# Altium schematic sheet Sheet1.SchDoc
size A3; PageSetup: Record=PageOptions|CenterHorizontal=True|CenterVertical=True|PrintScale=0.73|XCorrection=1.00|YCorrection=1.00|PrintKind=0|BorderSize=5000000|LeftOffset=0|BottomOffset=0|Orientation=2|PaperLength=1000|PaperWidth=1000|Scale=100|PaperSource=7|PrintQuality=-3|MediaType=1|DitherType=10|PrintScaleMode=1|PaperKind=A4|PaperIndex=9
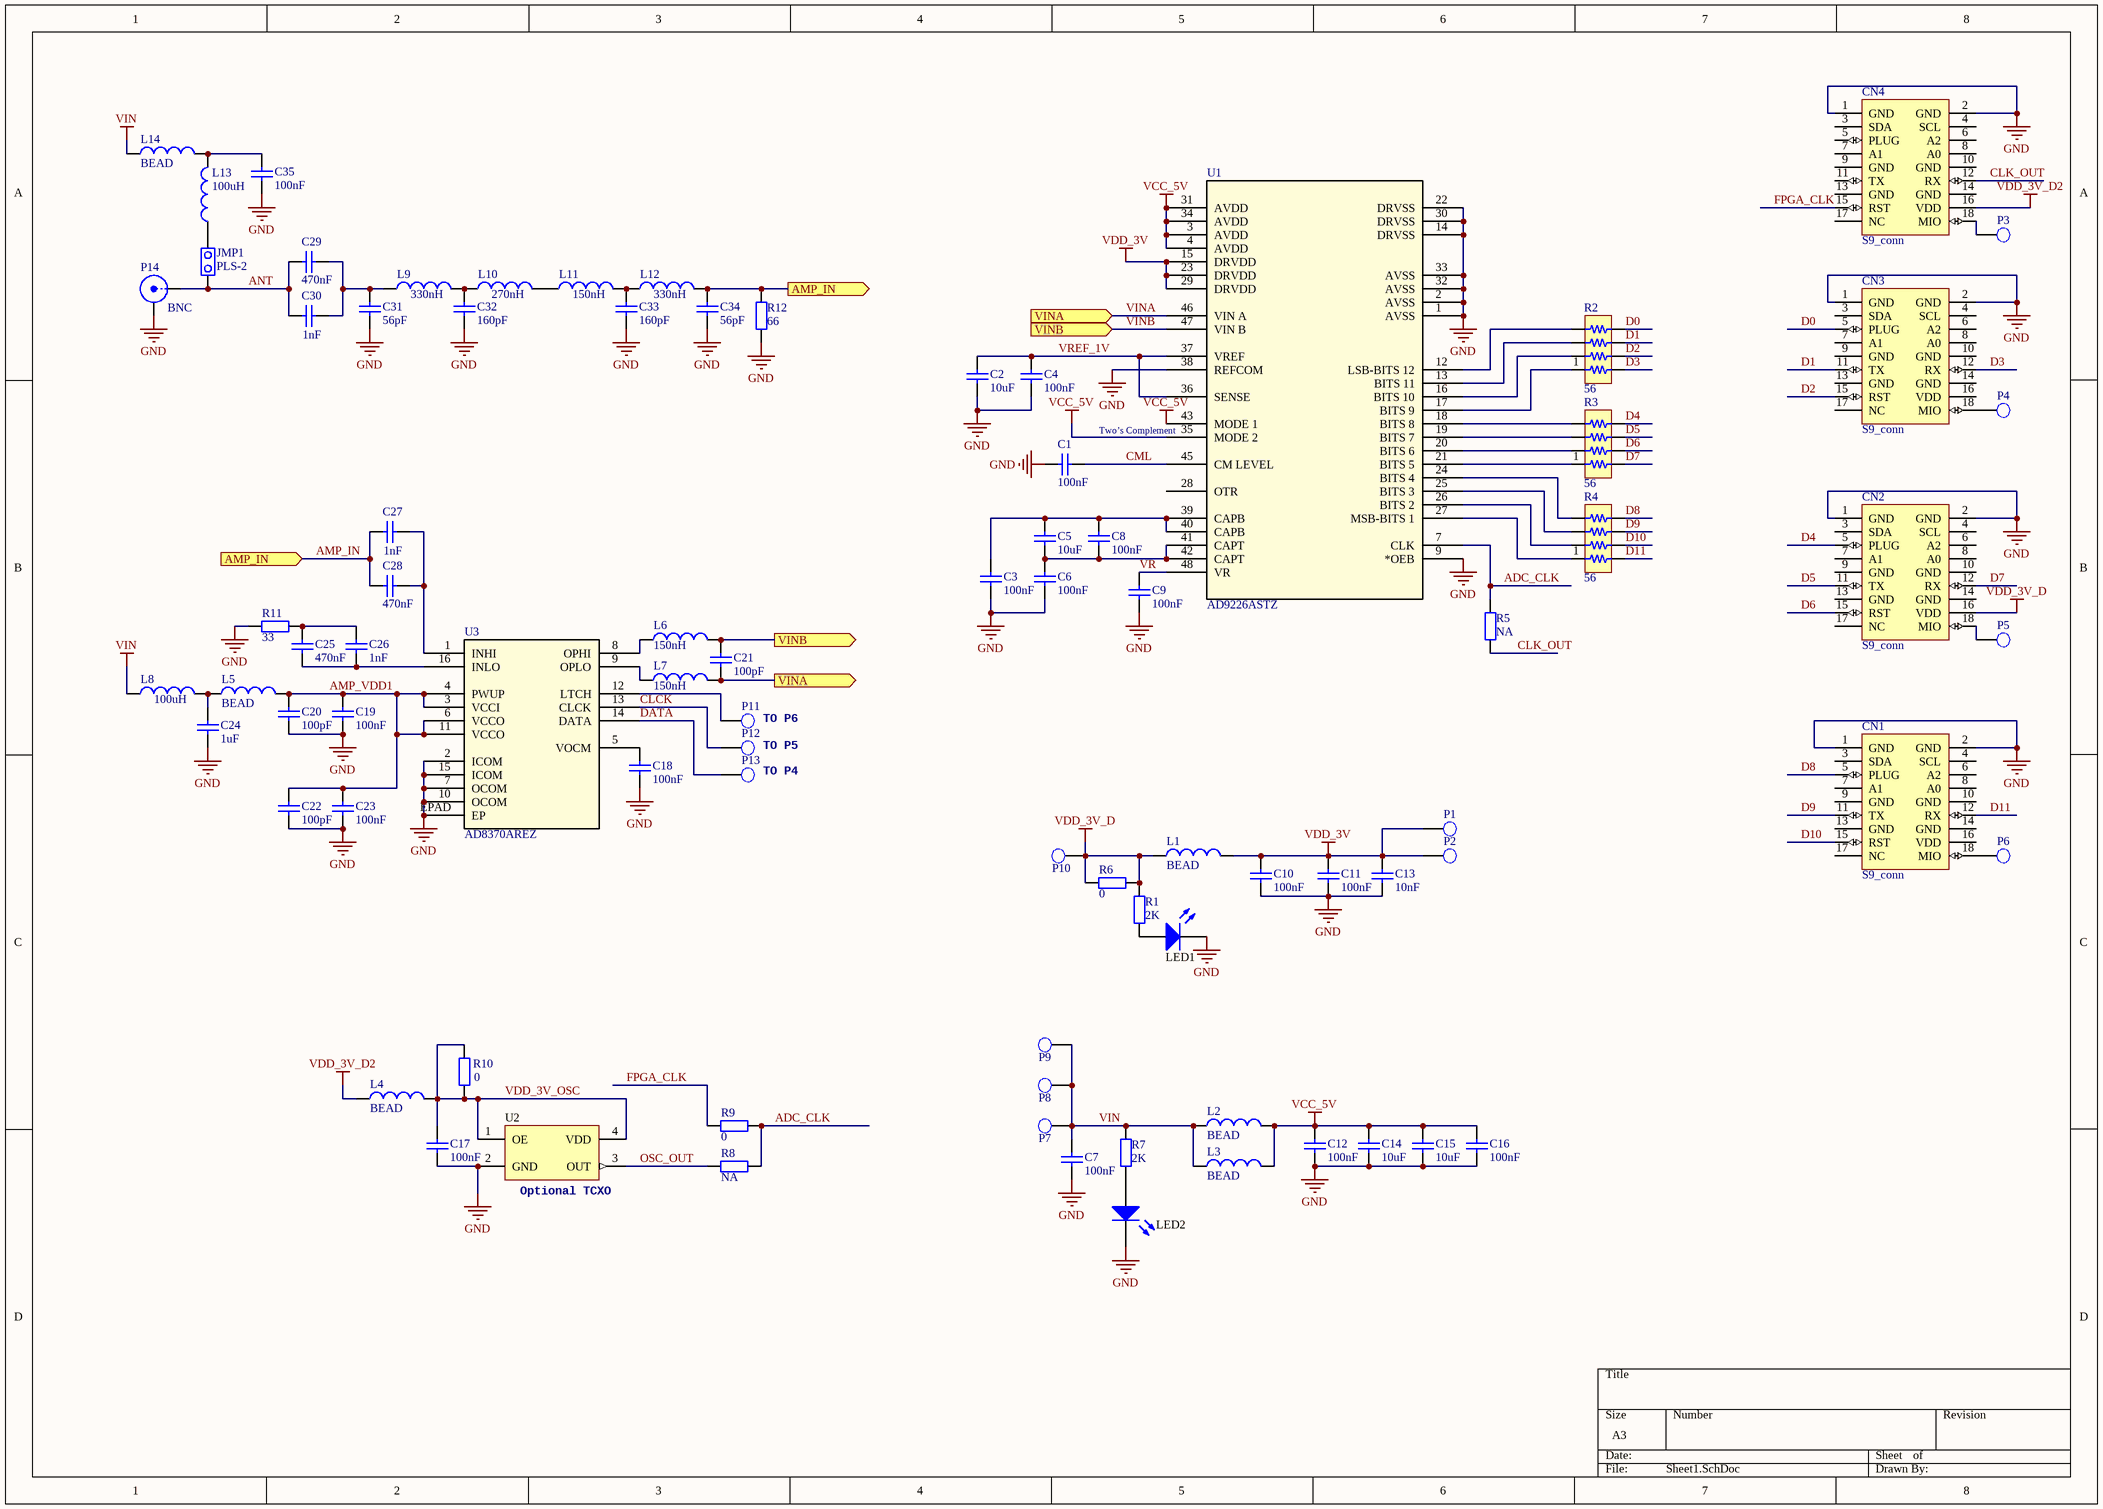
[diagram p0: Sheet1.SchDoc]

## Parts
C1  100nF  [CAPC1608X90N]
C2  10uF  [CAPC1608X90N]
C3  100nF  [CAPC1608X90N]
C4  100nF  [CAPC1608X90N]
C5  10uF  [CAPC1608X90N]
C6  100nF  [CAPC1608X90N]
C7  100nF  [CAPC1608X90N]
C8  100nF  [CAPC1608X90N]
C9  100nF  [CAPC1608X90N]
C10  100nF  [CAPC1608X90N]
C11  100nF  [CAPC1608X90N]
C12  100nF  [CAPC1608X90N]
C13  10nF  [CAPC1608X90N]
C14  10uF  [CAPC1608X90N]
C15  10uF  [CAPC1608X90N]
C16  100nF  [CAPC1608X90N]
C17  100nF  [CAPC1608X90N]
C18  100nF  [CAPC2012X135N]
C19  100nF  [CAPC1608X90N]
C20  100pF  [CAPC1608X90N]
C21  100pF  [CAPC1608X90N]
C22  100pF  [CAPC1608X90N]
C23  100nF  [CAPC1608X90N]
C24  1uF  [CAPC1608X90N]
C25  470nF  [CAPC1608X90N]
C26  1nF  [CAPC1608X90N]
C27  1nF  [CAPC1608X90N]
C28  470nF  [CAPC1608X90N]
C29  470nF  [CAPC1608X90N]
C30  1nF  [CAPC1608X90N]
C31  56pF  [CAPC1608X90N]
C32  160pF  [CAPC1608X90N]
C33  160pF  [CAPC1608X90N]
C34  56pF  [CAPC1608X90N]
C35  100nF  [CAPC1608X90N]
CN1  S9_conn  [CONN9_2]
CN2  S9_conn  [CONN9_2]
CN3  S9_conn  [CONN9_2]
CN4  S9_conn  [CONN9_2]
JMP1  PLS-2  [HDR_1x2]
L1  BEAD  [INDC1608N]
L2  BEAD  [INDC1608N]
L3  BEAD  [INDC1608N]
L4  BEAD  [INDC1608N]
L5  BEAD  [INDC1608N]
L6  value 150nH  [RESC2012X70N]  (hidden comment: Inductor)
L7  value 150nH  [RESC2012X70N]  (hidden comment: Inductor)
L8  value 100uH  [INDC3216]  (hidden comment: Inductor)
L9  value 330nH  [V0805HD]  (hidden comment: Inductor)
L10  value 270nH  [V0805HD]  (hidden comment: Inductor)
L11  value 150nH  [V0805HD]  (hidden comment: Inductor)
L12  value 330nH  [V0805HD]  (hidden comment: Inductor)
L13  value 100uH  [INDC3216]  (hidden comment: Inductor)
L14  BEAD  [INDC1608N]
LED1  LED  [LED_0603]  (value not drawn)
LED2  LED  [LED_0603]  (value not drawn)
P1  Pad  [Ext_pad_small2]  (value not drawn)
P2  Pad  [Ext_pad_small2]  (value not drawn)
P3  Pad  [Ext_pad_2]  (value not drawn)
P4  Pad  [Ext_pad_2]  (value not drawn)
P5  Pad  [Ext_pad_2]  (value not drawn)
P6  Pad  [Ext_pad_2]  (value not drawn)
P7  Pad  [Ext_pad_2]  (value not drawn)
P8  Pad  [Ext_hole]  (value not drawn)
P9  Pad  [Ext_hole]  (value not drawn)
P10  Pad  [Ext_pad_small2]  (value not drawn)
P11  Pad  [Ext_pad_small2]  (value not drawn)
P12  Pad  [Ext_pad_small2]  (value not drawn)
P13  Pad  [Ext_pad_small2]  (value not drawn)
P14  BNC  [BNC_RA CON]
R1  2K  [RESC1608X55N]
R2  56  [RESCAXS50P160X320X70-8N]
R3  56  [RESCAXS50P160X320X70-8N]
R4  56  [RESCAXS50P160X320X70-8N]
R5  NA  [RESC1608X55N]
R6  0  [RESC3216N_ZERO]
R7  2K  [RESC1608X55N]
R8  NA  [RESC1608X55N]
R9  0  [RESC1608X55N]
R10  0  [RESC3216N_ZERO]
R11  33  [RESC1608X55N]
R12  66  [RESC1608X55N]
U1  AD9226ASTZ  [ST_48_ADI]
U2  value 40MHz  [SX-6 QUARTZ]  (hidden comment: Quartz)
U3  AD8370AREZ  [RE_16_2_ADI]

## Ports
AMP_IN (in), AMP_IN (out), VINA (in), VINA (out), VINB (in), VINB (out)

## Nets
GND: C1.1 C2.1 C3.1 C4.1 C6.1 C7.1 C9.1 C10.1 C11.1 C12.1 C13.1 C14.1 C15.1 C16.1 C17.1 C18.1 C19.1 C20.1 C22.1 C23.1 C24.1 C31.1 C32.1 C33.1 C34.1 C35.1 CN1.1(GND) CN1.2(GND) CN2.1(GND) CN2.2(GND) CN3.1(GND) CN3.2(GND) CN4.1(GND) CN4.2(GND) LED1.2(K) LED2.2(K) P14.2(Y) R11.2 R12.2 U1.1(AVSS) U1.2(AVSS) U1.9(*OEB) U1.14(DRVSS) U1.22(DRVSS) U1.30(DRVSS) U1.32(AVSS) U1.33(AVSS) U1.38(REFCOM) U2.2(GND) U3.2(ICOM) U3.7(OCOM) U3.10(OCOM) U3.15(ICOM) U3.EPAD(EP)
VCC_5V: C12.2 C14.2 C15.2 C16.2 L2.2 L3.2 U1.3(AVDD) U1.4(AVDD) U1.31(AVDD) U1.34(AVDD) U1.35(MODE_2) U1.43(MODE_1)
VDD_3V: C10.2 C11.2 C13.2 L1.2 P1.1(Pad) P2.1(Pad) U1.15(DRVDD) U1.23(DRVDD) U1.29(DRVDD)
VDD_3V_D: CN2.16(VDD) L1.1 P10.1(Pad) R1.1 R6.1 R6.2
VDD_3V_D2: CN4.16(VDD) L4.1
VIN: C7.2 L2.1 L3.1 L8.1 L14.1 P7.1(Pad) P8.1(Pad) P9.1(Pad) R7.2
ADC_CLK: R5.1 R8.1 R9.1 U1.7(CLK)
AMP_IN: C27.2 C28.2 C34.2 L12.2 R12.1 ; port AMP_IN
AMP_VDD1: C19.2 C20.2 C22.2 C23.2 L5.2 U3.3(VCCI) U3.4(PWUP) U3.6(VCCO) U3.11(VCCO)
ANT: C29.2 C30.2 JMP1.1 P14.1(X)
CLCK: P12.1(Pad) U3.13(CLCK)
CLK_OUT: CN4.12(RX) R5.2
CML: C1.2 U1.45(CM_LEVEL)
D0: CN3.5(PLUG) R2.5
D1: CN3.11(TX) R2.6
D2: CN3.15(RST) R2.7
D3: CN3.12(RX) R2.8
D4: CN2.5(PLUG) R3.5
D5: CN2.11(TX) R3.6
D6: CN2.15(RST) R3.7
D7: CN2.12(RX) R3.8
D8: CN1.5(PLUG) R4.5
D9: CN1.11(TX) R4.6
D10: CN1.15(RST) R4.7
D11: CN1.12(RX) R4.8
DATA: P13.1(Pad) U3.14(DATA)
FPGA_CLK: CN4.15(RST) R9.2
OSC_OUT: R8.2 U2.3(OUT)
VDD_3V_OSC: C17.2 L4.2 R10.1 R10.2 U2.1(OE) U2.4(VDD)
VINA: C21.1 L7.2 U1.46(VIN_A) ; port VINA
VINB: C21.2 L6.2 U1.47(VIN_B) ; port VINB
VR: C9.2 U1.48(VR)
VREF_1V: C2.2 C4.2 U1.36(SENSE) U1.37(VREF)
NetC3_2: C3.2 C5.2 C8.2 U1.39(CAPB) U1.40(CAPB)
NetC5_1: C5.1 C6.2 C8.1 U1.41(CAPT) U1.42(CAPT)
NetC18_2: C18.2 U3.5(VOCM)
NetC24_2: C24.2 L5.1 L8.2
NetC25_1: C25.1 C26.1 U3.16(INLO)
NetC25_2: C25.2 C26.2 R11.1
NetC27_1: C27.1 C28.1 U3.1(INHI)
NetC29_1: C29.1 C30.1 C31.2 L9.1
NetC32_2: C32.2 L9.2 L10.1
NetC33_2: C33.2 L11.2 L12.1
NetC35_2: C35.2 L13.2 L14.2
NetCN1_18: CN1.18(MIO) P6.1(Pad)
NetCN2_18: CN2.18(MIO) P5.1(Pad)
NetCN3_18: CN3.18(MIO) P4.1(Pad)
NetCN4_18: CN4.18(MIO) P3.1(Pad)
NetJMP1_2: JMP1.2 L13.1
NetL6_1: L6.1 U3.8(OPHI)
NetL7_1: L7.1 U3.9(OPLO)
NetL10_2: L10.2 L11.1
NetLED1_1: LED1.1(A) R1.2
NetLED2_1: LED2.1(A) R7.1
NetP11_1: P11.1(Pad) U3.12(LTCH)
NetR2_1: R2.1 U1.17(BITS_9)
NetR2_2: R2.2 U1.16(BITS_10)
NetR2_3: R2.3 U1.13(BITS_11)
NetR2_4: R2.4 U1.12(LSB-BITS_12)
NetR3_1: R3.1 U1.21(BITS_5)
NetR3_2: R3.2 U1.20(BITS_6)
NetR3_3: R3.3 U1.19(BITS_7)
NetR3_4: R3.4 U1.18(BITS_8)
NetR4_1: R4.1 U1.27(MSB-BITS_1)
NetR4_2: R4.2 U1.26(BITS_2)
NetR4_3: R4.3 U1.25(BITS_3)
NetR4_4: R4.4 U1.24(BITS_4)

Not connected (* = marked no-connect by the designer): CN1 3(SDA) 4(SCL) 6(A2) 7(A1) 8(A0) 9(GND) 10(GND) 13(GND) 14(GND) 16(VDD) 17(NC); CN2 3(SDA) 4(SCL) 6(A2) 7(A1) 8(A0) 9(GND) 10(GND) 13(GND) 14(GND) 17(NC); CN3 3(SDA) 4(SCL) 6(A2) 7(A1) 8(A0) 9(GND) 10(GND) 13(GND) 14(GND) 16(VDD) 17(NC); CN4 3(SDA) 4(SCL) 5(PLUG) 6(A2) 7(A1) 8(A0) 9(GND) 10(GND) 11(TX) 13(GND) 14(GND) 17(NC); U1 28(OTR)

## Notes on the sheet
- Two’s Complement
- TO P6
- TO P4
- TO P5
- (near U2) Optional TCXO

## Library data of the parts
C1-C35 = CC0805: Chip capacitor; Voltage: 25V; Series: X7R
  C1 C3 C4 C6-C12 C16-C19 C23 C35: Value: 100nF
  C2 C5 C14 C15: Value: 10uF
  C13: Value: 10nF
  C20-C22: Value: 100pF
  C24: Value: 1uF
  C25 C28 C29: Value: 470nF
  C26 C27 C30: Value: 1nF
  C31 C34: Value: 56pF
  C32 C33: Value: 160pF
JMP1 = JMP2: Jumper; Created data: 2010-11-12; Value: PLS-2
L1-L5 L14 = BEAD: Ferrit Bead; Created data: 2010-10-16; Value: BEAD
L6-L13 = Inductor: Code_IEC: 1005; Published: 8-Jun-2000; LatestRevisionDate: 29-May-2009; LatestRevisionNote: IPC-7351 Footprint Added.; PackageReference: 0402-A; Publisher: Altium Limited; PackageDescription: Chip Inductor; Code_JEITA: 0402
LED1 LED2 = LED_0603
P1-P13 = Ext Pad: Pad for wire
P14 = BNC: BNC Elbow Connector; LatestRevisionDate: 17-Jul-2002; LatestRevisionNote: Re-released for DXP Platform.; Publisher: Altium Limited
R1 R5-R12 = RC0805: Chip resistor; Tolerance: 5%
  R1 R7: Value: 2K
  R5 R8: Value: NA
  R6 R9 R10: Value: 0
  R11: Value: 33
  R12: Value: 66
R2-R4 = res_array_inv: SMT Resistor Array; Value: 56
U1 = AD9226ASTZ: No Description Available; Mfr_Name: Analog Devices Inc; RefDes: RefDes; Type: Type
U2 = Quartz Osc
U3 = AD8370AREZ: No Description Available; Mfr_Name: Analog Devices Inc; RefDes: RefDes; Type: Type